# Altium schematic sheet 单通道刺激输出.SchDoc
size A3; Date: 2011.10.28; : 单通道刺激输出原理图; DrawnBy: Phoenix Joe; : 单通道刺激输出原理图; SheetNumber: 2
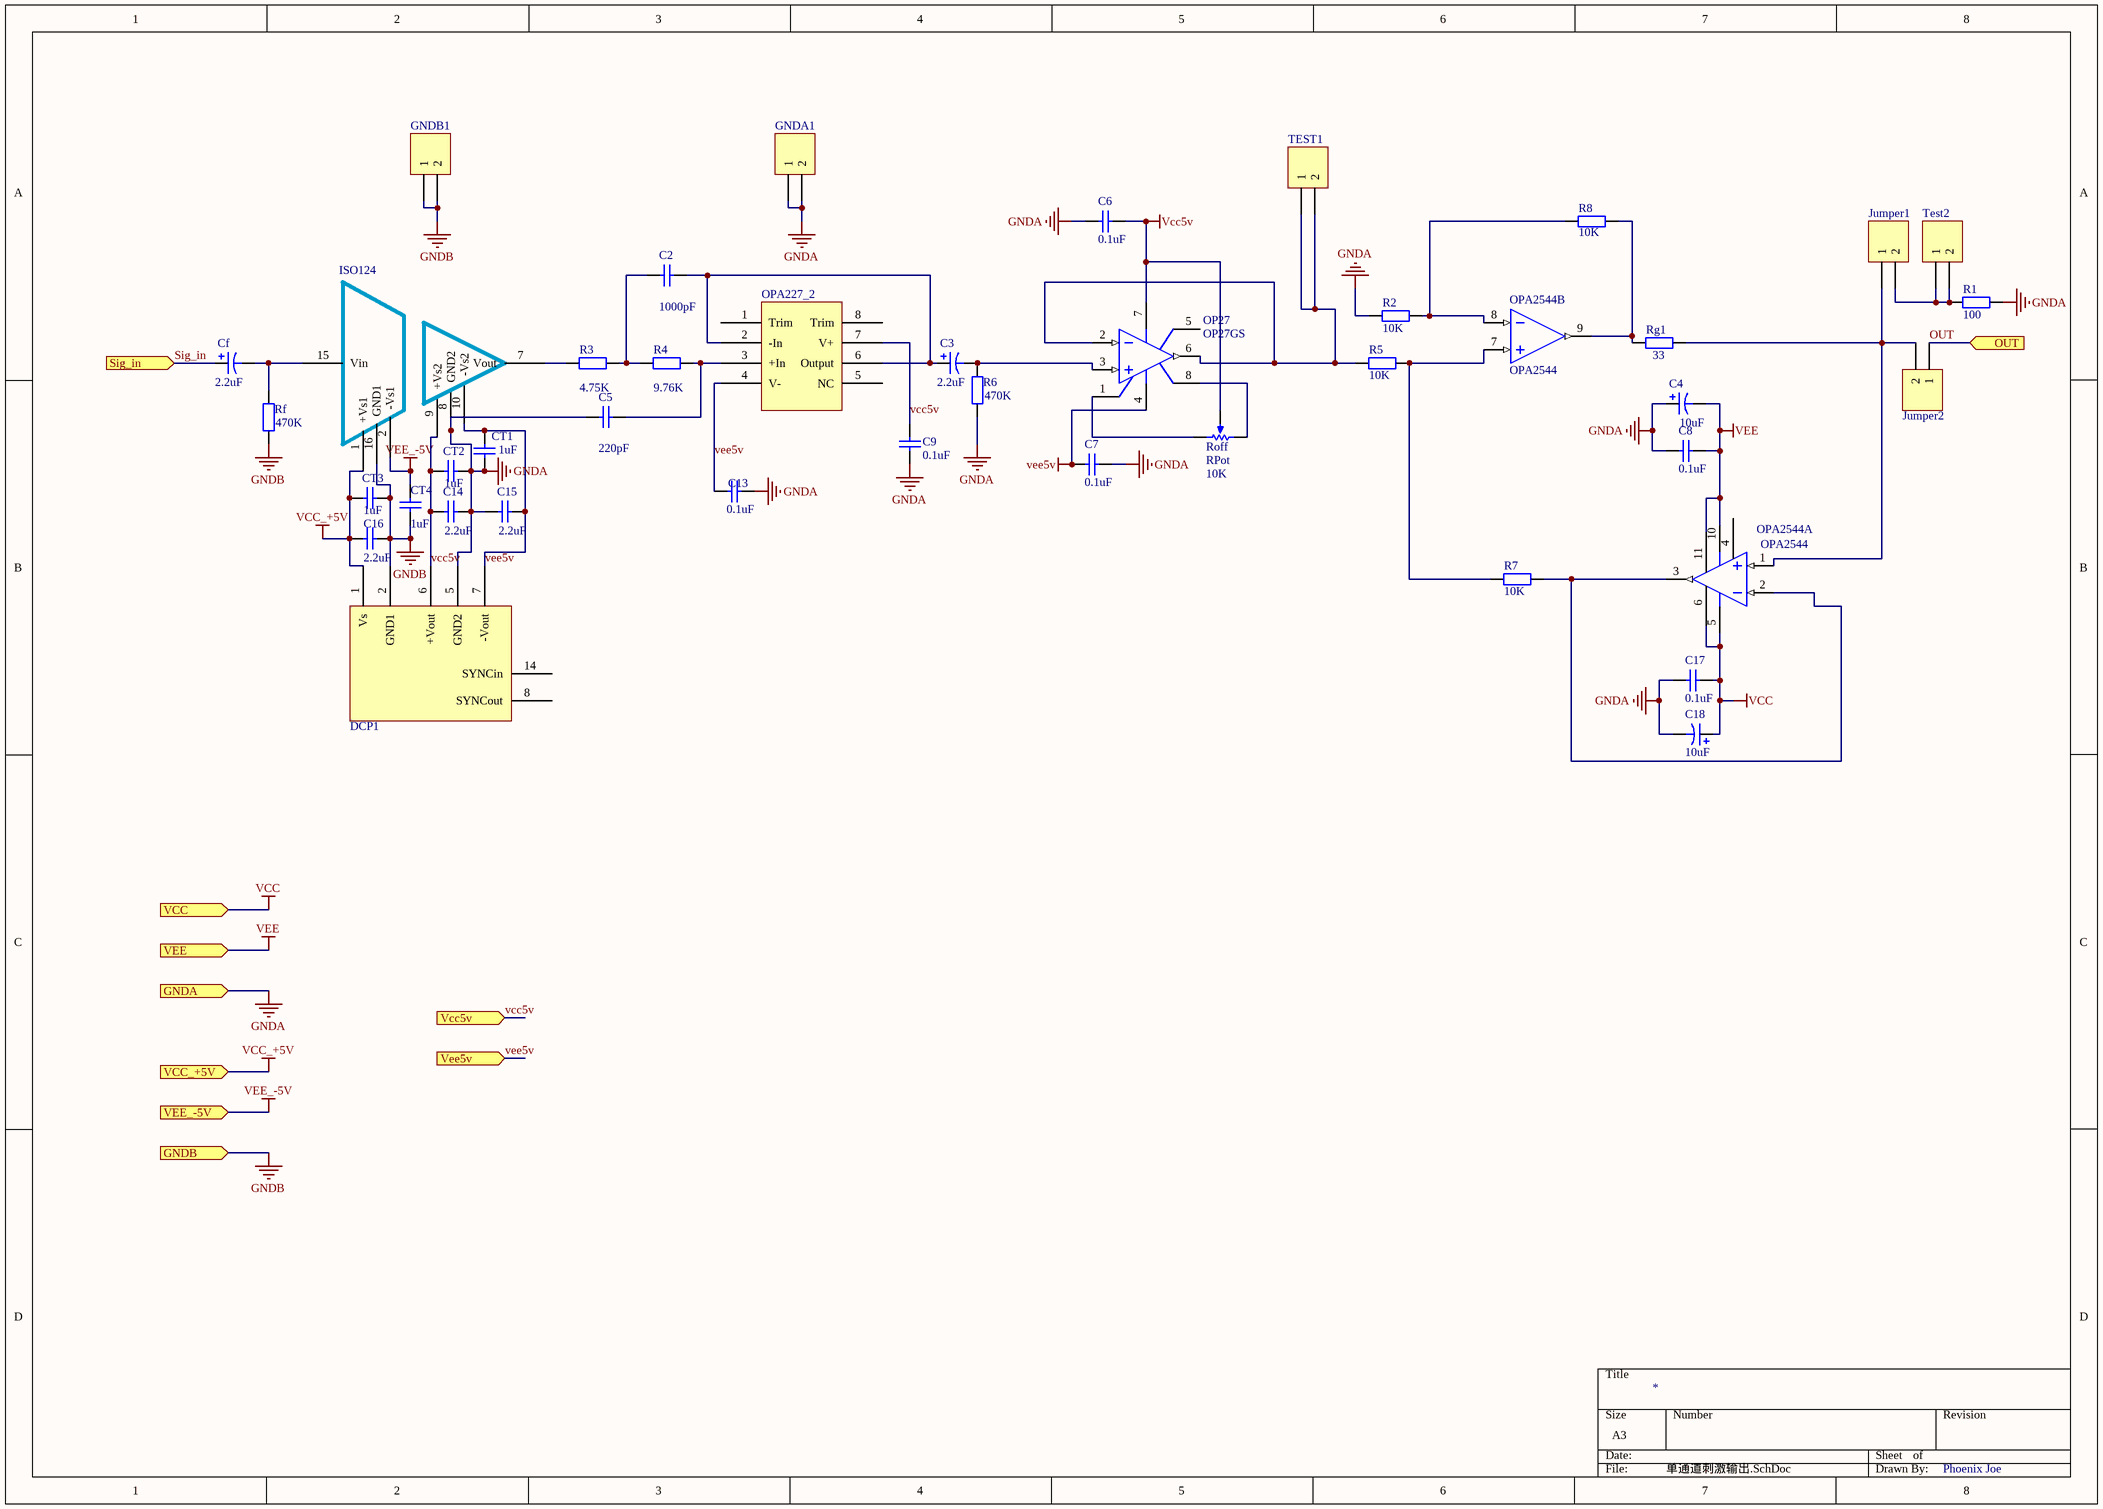
[diagram p0: 单通道刺激输出.SchDoc]

## Parts
C2  value 1000pF  [cap0603]  (hidden comment: 1000p)
C3  value 2.2uF  [TAN_CAP-A]  (hidden comment: 2.2u)
C4  value 10uF  [TAN_CAP-B]  (hidden comment: 10u)
C5  value 220pF  [cap0603]  (hidden comment: 220p)
C6  value 0.1uF  [cap0603]  (hidden comment: 0.1u)
C7  value 0.1uF  [cap0603]  (hidden comment: 0.1u)
C8  value 0.1uF  [RAD-0.2]  (hidden comment: 0.1u)
C9  value 0.1uF  [cap0603]  (hidden comment: 0.1u)
C13  value 0.1uF  [cap0603]  (hidden comment: 0.1u)
C14  value 2.2uF  [cap0603]  (hidden comment: 2.2u)
C15  value 2.2uF  [cap0603]  (hidden comment: 2.2u)
C16  value 2.2uF  [cap0603]  (hidden comment: 2.2u)
C17  value 0.1uF  [RAD-0.2]  (hidden comment: 0.1u)
C18  value 10uF  [TAN_CAP-B]  (hidden comment: 10u)
Cf  value 2.2uF  [TAN_CAP-A]  (hidden comment: 2.2u)
CT1  value 1uF  [cap0603]  (hidden comment: 1u)
CT2  value 1uF  [cap0603]  (hidden comment: 1u)
CT3  value 1uF  [cap0603]  (hidden comment: 1u)
CT4  value 1uF  [cap0603]  (hidden comment: 1u)
DCP1  DCP010505DB  [DIP-14]  (value not drawn)
GNDA1  Header 2  [HDR1X2]  (value not drawn)
GNDB1  Header 2  [HDR1X2]  (value not drawn)
ISO124  ISO124  [DIP-16]  (value not drawn)
Jumper1  Header 2  [HDR1X2]  (value not drawn)
Jumper2  Header 2  [HDR1X2]  (value not drawn)
OP27  OP27GS  [OPA227(D)]
OPA227_2  OPA227  [OPA227(D)]  (value not drawn)
OPA2544  OPA2544  [OPA2544]  (parts A,B of 2)
R1  100  [RES0603]
R2  10k  [RES0603]
R3  4.75k  [RES0603]
R4  9.76k  [RES0603]
R5  10k  [RES0603]
R6  470k  [RES0603]
R7  10k  [RES0603]
R8  10k  [RES0603]
Rf  470k  [RES0603]
Rg1  33  [AXIAL-0.5]
Roff  RPot  value 10K  [POT4MM-2]
TEST1  Header 2  [HDR1X2]  (value not drawn)
Test2  Header 2  [HDR1X2]  (value not drawn)

## Ports
GNDA (in), GNDB (in), OUT (in), Sig_in (in), Vcc5v (in), VCC (in), VCC_+5V (in), Vee5v (in), VEE (in), VEE_-5V (in)

## Nets
GNDA: C4.1 C5.2 C6.1 C7.1 C8.1 C9.1 C13.1 C14.2 C15.1 C17.1 C18.2 CT1.1 CT2.2 DCP1.5(GND2) GNDA1.1 GNDA1.2 ISO124.8(GND2) R1.2 R2.1 R6.1 ; port GNDA
GNDB: C16.2 CT3.2 CT4.1 DCP1.2(GND1) GNDB1.1 GNDB1.2 ISO124.16(GND1) Rf.1 ; port GNDB
VCC: C17.2 C18.1 OPA2544.5(V+) OPA2544.6(V+) ; port VCC
vcc5v: C6.2 C9.2 C14.1 CT2.1 DCP1.6(+Vout) ISO124.9(+Vs2) OP27.7(V+) OPA227_2.7(V+) Roff.w(TAP) ; port Vcc5v
VCC_+5V: C16.1 CT3.1 DCP1.1(Vs) ISO124.1(+Vs1) ; port VCC_+5V
VEE: C4.2 C8.2 OPA2544.10(V-) OPA2544.11(V-) ; port VEE
vee5v: C7.2 C13.2 C15.2 CT1.2 DCP1.7(-Vout) ISO124.10(-Vs2) OP27.4(V-) OPA227_2.4(V-) ; port Vee5v
VEE_-5V: CT4.2 ISO124.2(-Vs1) ; port VEE_-5V
OUT: Jumper2.1 ; port OUT
Sig_in: Cf.1 ; port Sig_in
NetC2_1: C2.1 R3.2 R4.1
NetC2_2: C2.2 C3.1 OPA227_2.2(-In) OPA227_2.6(Output)
NetC3_2: C3.2 OP27.3(IN+) R6.2
NetC5_1: C5.1 OPA227_2.3(+In) R4.2
NetCf_2: Cf.2 ISO124.15(Vin) Rf.2
NetISO124_7: ISO124.7(Vout) R3.1
NetJumper1_1: Jumper1.1 Jumper2.2 OPA2544.1(IN+) Rg1.2
NetJumper1_2: Jumper1.2 R1.1 Test2.1 Test2.2
NetOP27_1: OP27.1(CMPEN) Roff.ccw(BOT)
NetOP27_2: OP27.2(IN-) OP27.6(OUT) R5.1 TEST1.1 TEST1.2
NetOP27_8: OP27.8(CMPEN) Roff.cw(TOP)
NetOPA2544_2: OPA2544.2(IN-) OPA2544.3(OUT) R7.2
NetOPA2544_7: OPA2544.7(IN+) R5.2 R7.1
NetOPA2544_8: OPA2544.8(IN-) R2.2 R8.2
NetOPA2544_9: OPA2544.9(OUT) R8.1 Rg1.1

Not connected (* = marked no-connect by the designer): DCP1 8(SYNCout) 14(SYNCin); OP27 5(NC); OPA227_2 1(Trim) 5(NC) 8(Trim); OPA2544 4(NC)

## Library data of the parts
C2 C5-C9 C13-C17 CT1-CT4 = Cap: Capacitor; Published: 8-Jun-2000; LatestRevisionDate: 17-Jul-2002; LatestRevisionNote: Re-released for DXP Platform.; PackageReference: RAD-0.3; Publisher: Altium Limited
C3 C4 C18 Cf = Cap Pol1: Polarized Capacitor (Radial); Published: 8-Jun-2000; LatestRevisionDate: 17-Jul-2002; LatestRevisionNote: Re-released for DXP Platform.; PackageReference: RB7.6-15; Publisher: Altium Limited
GNDA1 GNDB1 Jumper1 Jumper2 TEST1 Test2 = Header 2: Header, 2-Pin; LatestRevisionDate: 17-Jul-2002; LatestRevisionNote: Re-released for DXP Platform.; Publisher: Altium Limited
OP27 = OP27GS: Low-Noise, Precision Operational Amplifier; Note: Pin 5 is not connected.; Published: 8-Jun-2000; LatestRevisionDate: 13-Apr-2006; LatestRevisionNote: IPC-7351 Footprint Added.; DatasheetVersion: 1992; PackageVersion: revA; PackageReference: SO-8; Publisher: Altium Limited; PackageDescription: 8-Pin Small Outline Integrated Circuit 1.27 mm Pitch; Code_JEDEC: MS-012-AA; Code_IPC: SOIC127P600-8; ComponentLink1Description: Manufacturer Link; ComponentLink1URL: http://www.analog.com/en/prod/0,,759_786_OP27%2C00.html; ComponentLink2Description: Datasheet; ComponentLink2URL: http://www.analog.com/UploadedFiles/Data_Sheets/314538596OP27_c.pdf
OPA2544 = OPA
R1-R8 Rf Rg1 = Res2: Resistor; Published: 8-Jun-2000; LatestRevisionDate: 17-Jul-2002; LatestRevisionNote: Re-released for DXP Platform.; PackageReference: AXIAL-0.4; Publisher: Altium Limited
  R1: Value: 100
  R2 R5 R7 R8: Value: 10K
  R3: Value: 4.75K
  R4: Value: 9.76K
  R6 Rf: Value: 470K
  Rg1: Value: 33
Roff = RPot: Potentiometer; Sim Note: Enter the Resistance value and the set point into parameter fields.; Set Position: 0.5; Published: 8-Jun-2000; LatestRevisionDate: 17-Jul-2002; LatestRevisionNote: Re-released for DXP Platform.; PackageReference: VR5; Publisher: Altium Limited